# EAGLE design SonarandLEDBoard (EAGLE 9.6.2)
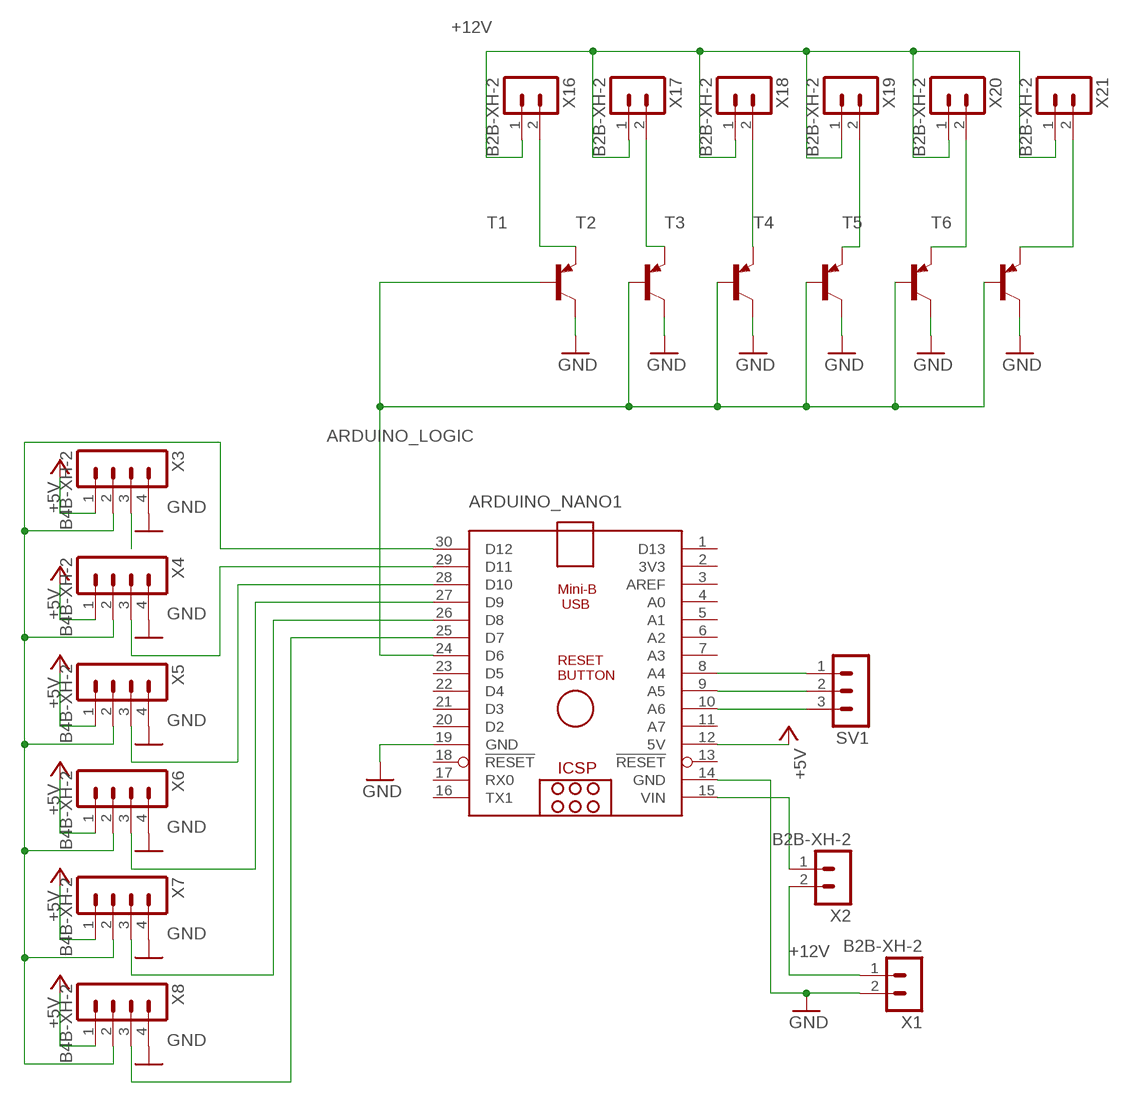
[diagram p0: schematic, sheet 1]

## Parts
ARDUINO_NANO1  ARDUINO_NANO  [ARDUINO_NANO]
SV1  MA03-1  [MA03-1]
T1  -PNP-TOP3V  [TOP3V]
T2  -PNP-TOP3V  [TOP3V]
T3  -PNP-TOP3V  [TOP3V]
T4  -PNP-TOP3V  [TOP3V]
T5  -PNP-TOP3V  [TOP3V]
T6  -PNP-TOP3V  [TOP3V]
X1  B2B-XH-2  [B2B-XH-A]
X2  B2B-XH-2  [B2B-XH-A]
X3  B4B-XH-2  [B4B-XH-A]
X4  B4B-XH-2  [B4B-XH-A]
X5  B4B-XH-2  [B4B-XH-A]
X6  B4B-XH-2  [B4B-XH-A]
X7  B4B-XH-2  [B4B-XH-A]
X8  B4B-XH-2  [B4B-XH-A]
X16  B2B-XH-2  [B2B-XH-A]
X17  B2B-XH-2  [B2B-XH-A]
X18  B2B-XH-2  [B2B-XH-A]
X19  B2B-XH-2  [B2B-XH-A]
X20  B2B-XH-2  [B2B-XH-A]
X21  B2B-XH-2  [B2B-XH-A]

## Nets
+5V: ARDUINO_NANO1.12(5V) X3.1 X4.1 X5.1 X6.1 X7.1 X8.1
+12V: X1.1 X2.2 X16.1 X17.1 X18.1 X19.1 X20.1 X21.1
ARDUINO_LOGIC: ARDUINO_NANO1.24(D6) T1.B T2.B T3.B T4.B T5.B T6.B
GND: ARDUINO_NANO1.14(GND) ARDUINO_NANO1.19(GND) T1.C T2.C T3.C T4.C T5.C T6.C X1.2 X3.4 X4.4 X5.4 X6.4 X7.4 X8.4
N$1: ARDUINO_NANO1.8(A4) SV1.1
N$2: ARDUINO_NANO1.15(VIN) X2.1
N$3: ARDUINO_NANO1.9(A5) SV1.2
N$4: ARDUINO_NANO1.10(A6) SV1.3
N$23: T1.E X16.2
N$24: ARDUINO_NANO1.26(D8) X7.3
N$25: X3.3
N$27: ARDUINO_NANO1.29(D11) X4.3
N$28: ARDUINO_NANO1.28(D10) X5.3
N$30: T2.E X17.2
N$31: ARDUINO_NANO1.27(D9) X6.3
N$32: T3.E X18.2
N$33: T4.E X19.2
N$34: ARDUINO_NANO1.30(D12) X3.2 X4.2 X5.2 X6.2 X7.2 X8.2
N$35: ARDUINO_NANO1.25(D7) X8.3
N$36: T5.E X20.2
N$38: T6.E X21.2
Unconnected: ARDUINO_NANO1.1(D13) ARDUINO_NANO1.2(3V3) ARDUINO_NANO1.3(AREF) ARDUINO_NANO1.4(A0) ARDUINO_NANO1.5(A1) ARDUINO_NANO1.6(A2) ARDUINO_NANO1.7(A3) ARDUINO_NANO1.11(A7) ARDUINO_NANO1.13(!RESET) ARDUINO_NANO1.16(TX1) ARDUINO_NANO1.17(RX0) ARDUINO_NANO1.18(!RESET) ARDUINO_NANO1.20(D2) ARDUINO_NANO1.21(D3) ARDUINO_NANO1.22(D4) ARDUINO_NANO1.23(D5)

## Library data of the parts
ARDUINO_NANO1 = ArduinoNanoV31:ARDUINO_NANO: Arduino Nano V3.0 Overview: The Arduino Nano is a small, complete, and breadboard-friendly board based on the ATmega328 (Arduino Nano 3.x) or ATmega168 (Arduino Nano 2.x). It has more or less the same functionality of the Arduino Duemilanove, but in a different package. It lacks only a DC power jack, and works with a Mini-B USB cable instead of a standard one. The Nano was designed and is being produced by Gravitech. Specifications: Microcontroller Atmel ATmega168 or ATmega328 Operating Voltage (logic level) 5 V Input Voltage (recommended) 7-12 V Input Voltage (limits) 6-20 V Digital I/O Pins 14 (of which 6 provide PWM output) Analog Input Pins 8 DC Current per I/O Pin 40 mA Flash Memory 16 KB (ATmega168) or 32 KB (ATmega328) of which 2 KB used by bootloader SRAM 1 KB (ATmega168) or 2 KB (ATmega328) EEPROM 512 bytes (ATmega168) or 1 KB (ATmega328) Clock Speed 16 MHz Dimensions 0.73" x 1.70" Length 45 mm Width 18 mm Weigth 5 g Power: The Arduino Nano can be powered via the Mini-B USB connection, 6-20V unregulated external power supply (pin 30), or 5V regulated external power supply (pin 27). The power source is automatically selected to the highest voltage source. Memory: The ATmega168 has 16 KB of flash memory for storing code (of which 2 KB is used for the bootloader); the ATmega328 has 32 KB, (also with 2 KB used for the bootloader). The ATmega168 has 1 KB of SRAM and 512 bytes of EEPROM (which can be read and written with the EEPROM library); the ATmega328 has 2 KB of SRAM and 1 KB of EEPROM. Input and Output: Each of the 14 digital pins on the Nano can be used as an input or output, using pinMode(), digitalWrite(), and digitalRead() functions. They operate at 5 volts. Each pin can provide or receive a maximum of 40 mA and has an internal pull-up resistor (disconnected by default) of 20-50 kOhms. In addition, some pins have specialized functions. Visit Arduino - ArduinoBoardNano <https://www.arduino.cc/en/Main/ArduinoBoardNano>
SV1 = con-lstb:MA03-1: PIN HEADER; OC_FARNELL: unknown; OC_NEWARK: unknown
T1-T6 = transistor:*-PNP-: PNP Transistror
X1 X2 X16-X21 = con-JST XH:B2B-XH: JST XH series header 2.50mm pitch disconnectable crimp style connectors, vertical (side entry type), 2 pins
X3-X8 = con-JST XH:B4B-XH: JST XH series header 2.50mm pitch disconnectable crimp style connectors, vertical (side entry type), 4 pins

## Board
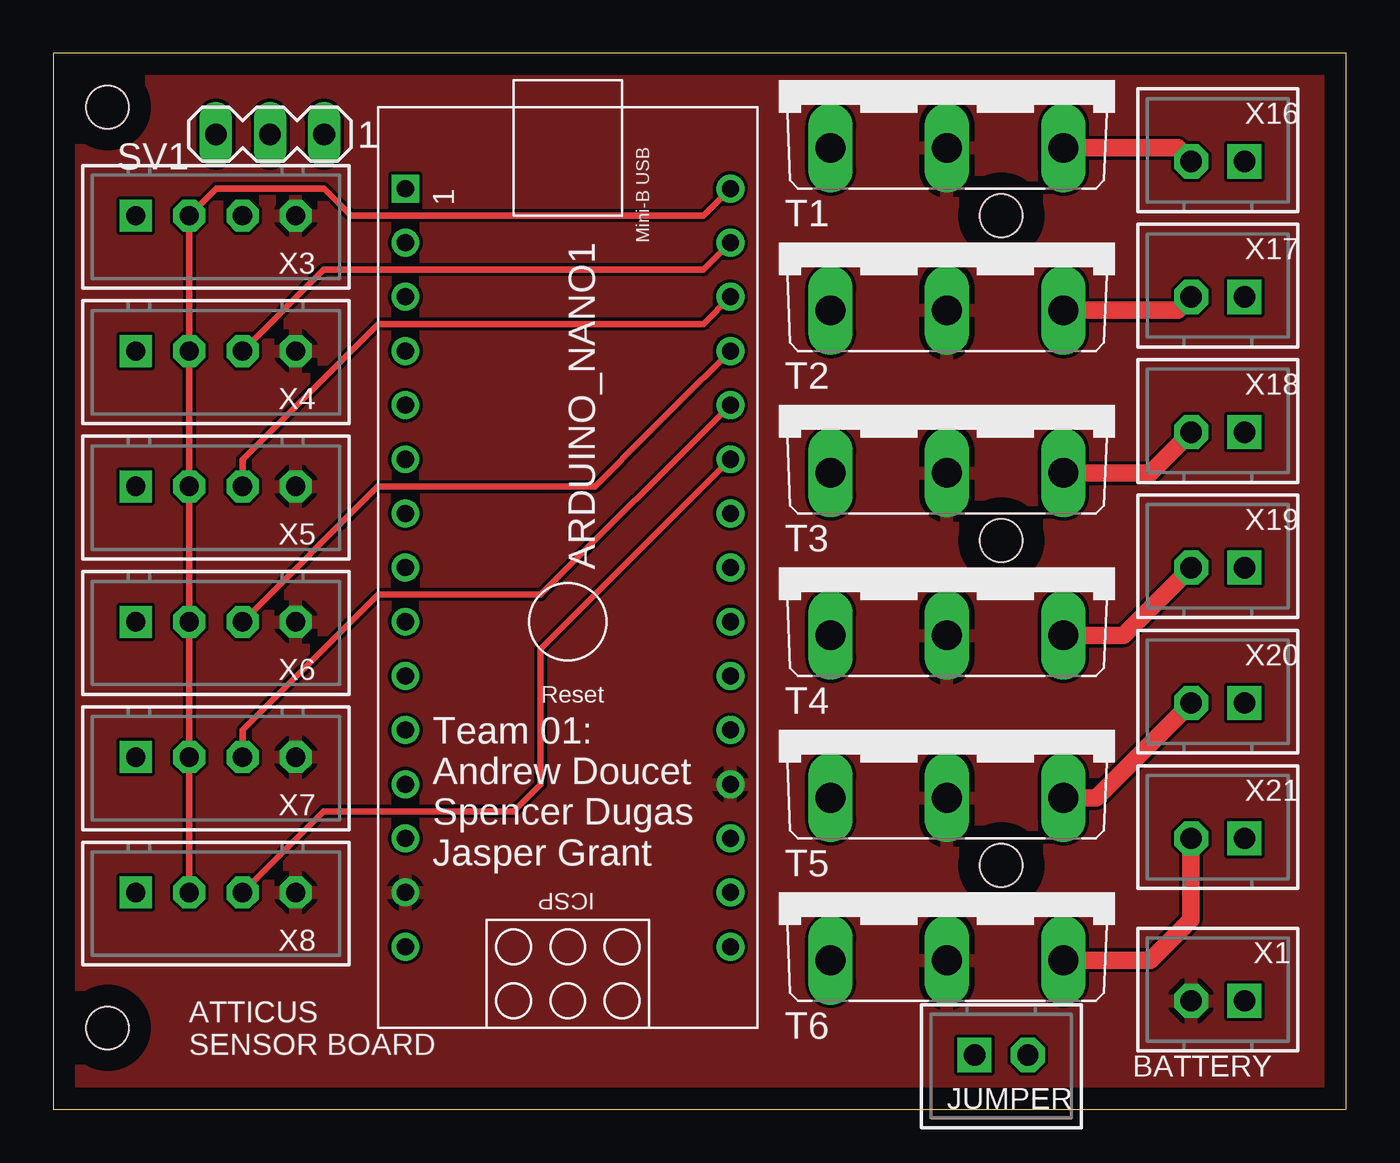
[diagram p1: board, top side]
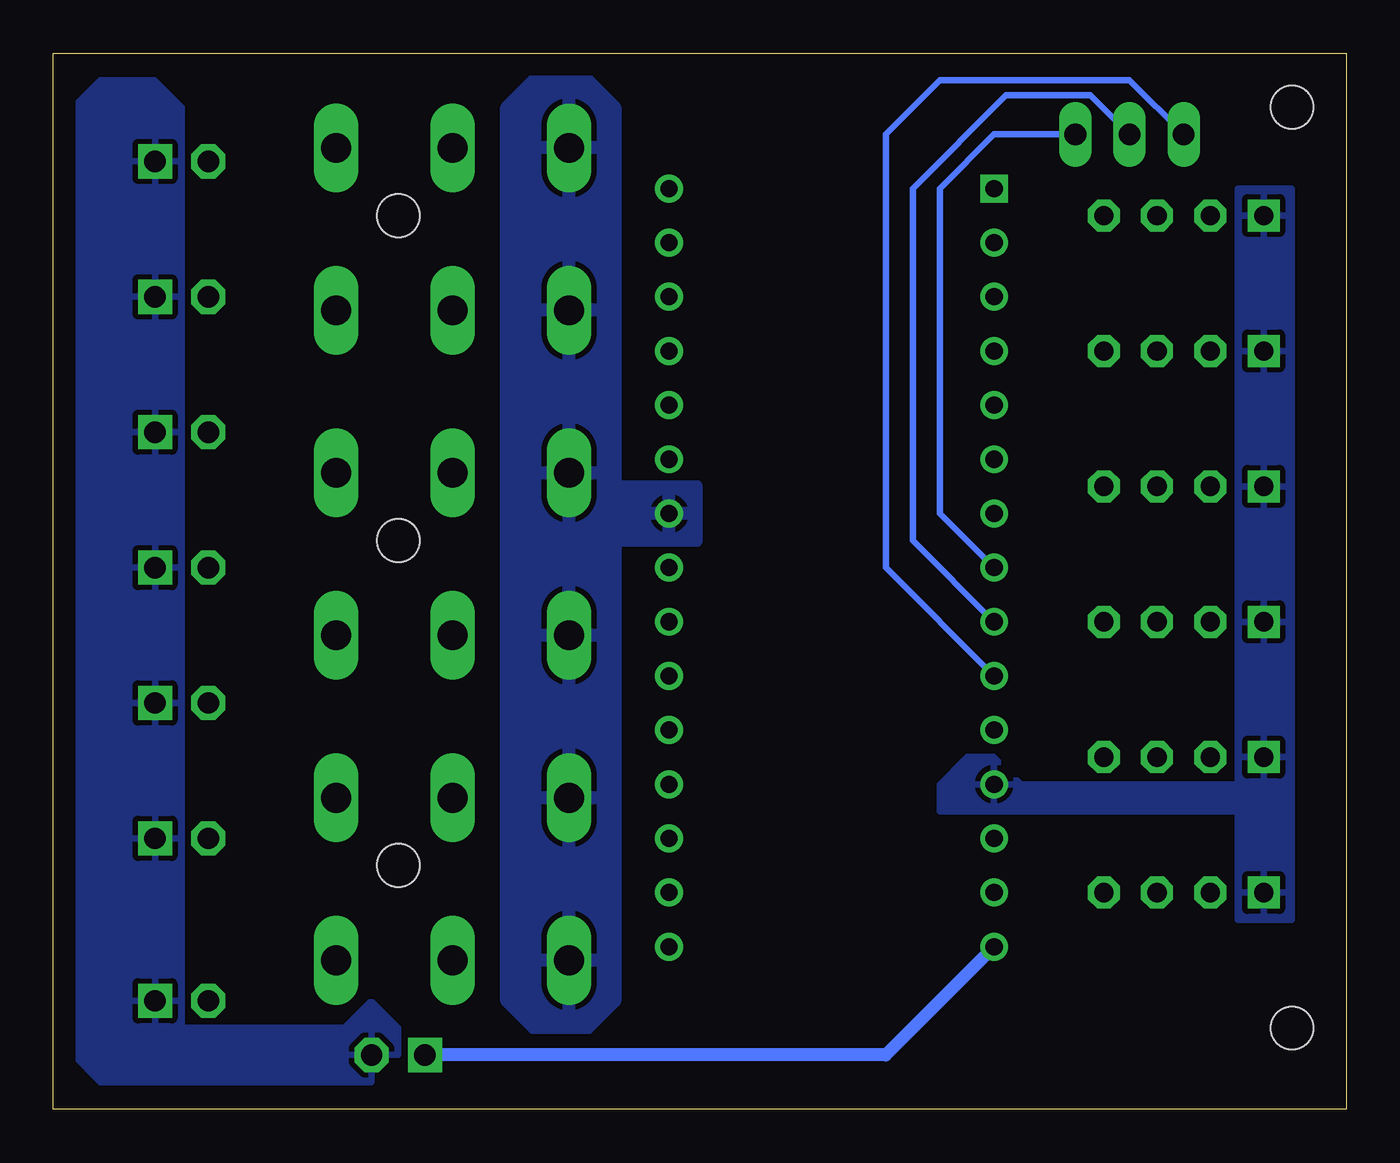
[diagram p2: board, bottom side, seen from below]

Size 60.63 x 49.52 mm. Coordinates in mm from the lower left corner, seen from the top.
Outline: 0,0 60.63,0 60.63,49.52 0,49.52 0,0
Copper layers (1*16): Top 0.035mm / dielectric 1.5mm / Bottom 0.035mm
Design rules "default": minimum track width 6mil, minimum drill 0.35mm, track to track 6mil, track to pad 6mil, pad to pad 6mil, via to via 6mil, smd to smd 6mil, copper to edge 40mil, drill to drill 6mil, minimum pad ring 10mil, minimum via ring 8mil, stop-mask expansion 4mil, vias tented up to drill 0mil, thermal gap 10mil
Holes 2 mm at 2.54,46.99 2.54,3.81 44.45,41.91 44.45,11.43 44.45,26.67

### Footprints (pad centres in the part's own frame; a part is rotated, then mirrored left to right if it is on the bottom)
ARDUINO_NANO = drill 0.8 square: 1 -20.32,-7.62 | drill 0.8: 2 -17.78,-7.62; 3 -15.24,-7.62; 4 -12.7,-7.62; 5 -10.16,-7.62; 6 -7.62,-7.62; 7 -5.08,-7.62; 8 -2.54,-7.62; 9 0,-7.62; 10 2.54,-7.62; 11 5.08,-7.62; 12 7.62,-7.62; 13 10.16,-7.62; 14 12.7,-7.62; 15 15.24,-7.62; 16 15.24,7.62; 17 12.7,7.62; 18 10.16,7.62; 19 7.62,7.62; 20 5.08,7.62; 21 2.54,7.62; 22 0,7.62; 23 -2.54,7.62; 24 -5.08,7.62; 25 -7.62,7.62; 26 -10.16,7.62; 27 -12.7,7.62; 28 -15.24,7.62; 29 -17.78,7.62; 30 -20.32,7.62
MA03-1 = drill 1.016 long: 1 -2.54,0; 2 0,0; 3 2.54,0
TOP3V = drill 1.397 long: B -5.461,-3.175; C 0,-3.175; E 5.461,-3.175
B2B-XH-A = drill 1 pad 1.6 square: 1 1.25,0 | drill 1 pad 1.6 octagon: 2 -1.25,0
B4B-XH-A = drill 0.9 pad 1.5 square: 1 3.75,0 | drill 0.9 pad 1.5 octagon: 2 1.25,0; 3 -1.25,0; 4 -3.75,0

### Placement (x,y rotation side)
ARDUINO_NANO1  24.13,22.86 270 top
SV1  10.16,45.72 180 top
T1  41.91,48.26 0 top
T2  41.91,40.64 0 top
T3  41.91,33.02 0 top
T4  41.91,25.4 0 top
T5  41.91,17.78 0 top
T6  41.91,10.16 0 top
X1  54.61,5.08 0 top
X2  44.45,2.54 180 top
X3  7.62,41.91 180 top
X4  7.62,35.56 180 top
X5  7.62,29.21 180 top
X6  7.62,22.86 180 top
X7  7.62,16.51 180 top
X8  7.62,10.16 180 top
X16  54.61,44.45 0 top
X17  54.61,38.1 0 top
X18  54.61,31.75 0 top
X19  54.61,25.4 0 top
X20  54.61,19.05 0 top
X21  54.61,12.7 0 top

### Tracks (layer width: path | path; a pad name or v marks a point on that pad's centre or on a via)
+5V
  pour Bottom: 17.78,13.97 15.24,13.97 5.08,13.97 5.08,8.89 2.54,8.89 2.54,43.18 5.08,43.18 5.08,15.24 15.24,15.24 16.51,16.51 17.78,16.51 19.05,15.24 19.05,13.97
+12V
  pour Bottom: 44.45,3.81 44.45,2.54 45.72,1.27 58.42,1.27 59.69,2.54 59.69,46.99 58.42,48.26 55.88,48.26 54.61,46.99 54.61,3.81 46.99,3.81 45.72,5.08
ARDUINO_LOGIC
  pour Bottom: 30.48,29.21 30.48,26.67 33.02,26.67 34.29,26.67 34.29,5.08 35.56,3.81 36.83,3.81 38.1,3.81 39.37,5.08 39.37,46.99 38.1,48.26 35.56,48.26 34.29,46.99 34.29,29.21
GND
  pour Top: 0,49.53 0,0 60.96,0 60.96,48.26 59.69,49.53
N$1
  Bottom 0.305: ARDUINO_NANO1.8 19.05,27.94 19.05,43.18 16.51,45.72 SV1.1
N$2
  Bottom 0.61: ARDUINO_NANO1.15 21.59,2.54 X2.1
N$3
  Bottom 0.305: ARDUINO_NANO1.9 20.32,26.67 20.32,43.18 15.95,47.55 11.99,47.55 SV1.2
N$4
  Bottom 0.305: SV1.3 10.16,48.26 19.05,48.26 21.59,45.72 21.59,25.4 ARDUINO_NANO1.10
N$23
  Top 0.813: T1.E 52.73,45.08 X16.2
N$24
  Top 0.305: X7.3 8.89,16.51 8.89,17.78 15.24,24.13 22.86,24.13 ARDUINO_NANO1.26
N$27
  Top 0.305: ARDUINO_NANO1.29 30.48,39.37 12.68,39.37 X4.3
N$28
  Top 0.305: ARDUINO_NANO1.28 30.48,36.83 15.24,36.83 8.87,30.46 X5.3
N$30
  Top 0.813: T2.E 52.73,37.46 X17.2
N$31
  Top 0.305: ARDUINO_NANO1.27 29.21,33.02 27.94,31.75 25.4,29.21 15.22,29.21 X6.3
N$32
  Top 0.813: T3.E 51.46,29.85 X18.2
N$33
  Top 0.813: T4.E 50.19,22.22 X19.2
N$34
  Top 0.305: X4.2 X3.2 7.64,43.18 12.7,43.18 13.97,41.91 30.48,41.91 ARDUINO_NANO1.30 | X4.2 X6.2 | X6.2 X5.2 X4.2 | X6.2 X7.2 X8.2
N$35
  Top 0.305: ARDUINO_NANO1.25 22.86,21.59 22.86,15.24 21.59,13.97 12.68,13.97 X8.3
N$36
  Top 0.813: T5.E 48.92,14.61 X20.2
N$38
  Top 0.813: X21.2 53.34,12.68 53.34,8.89 51.44,6.99 T6.E

### Text on the board
tNames: Team 01: / Andrew Doucet / Spencer Dugas / Jasper Grant | ATTICUS / SENSOR BOARD | BATTERY | JUMPER